# Altium schematic sheet OpenUltrasound_Pulser.SchDoc
size A3
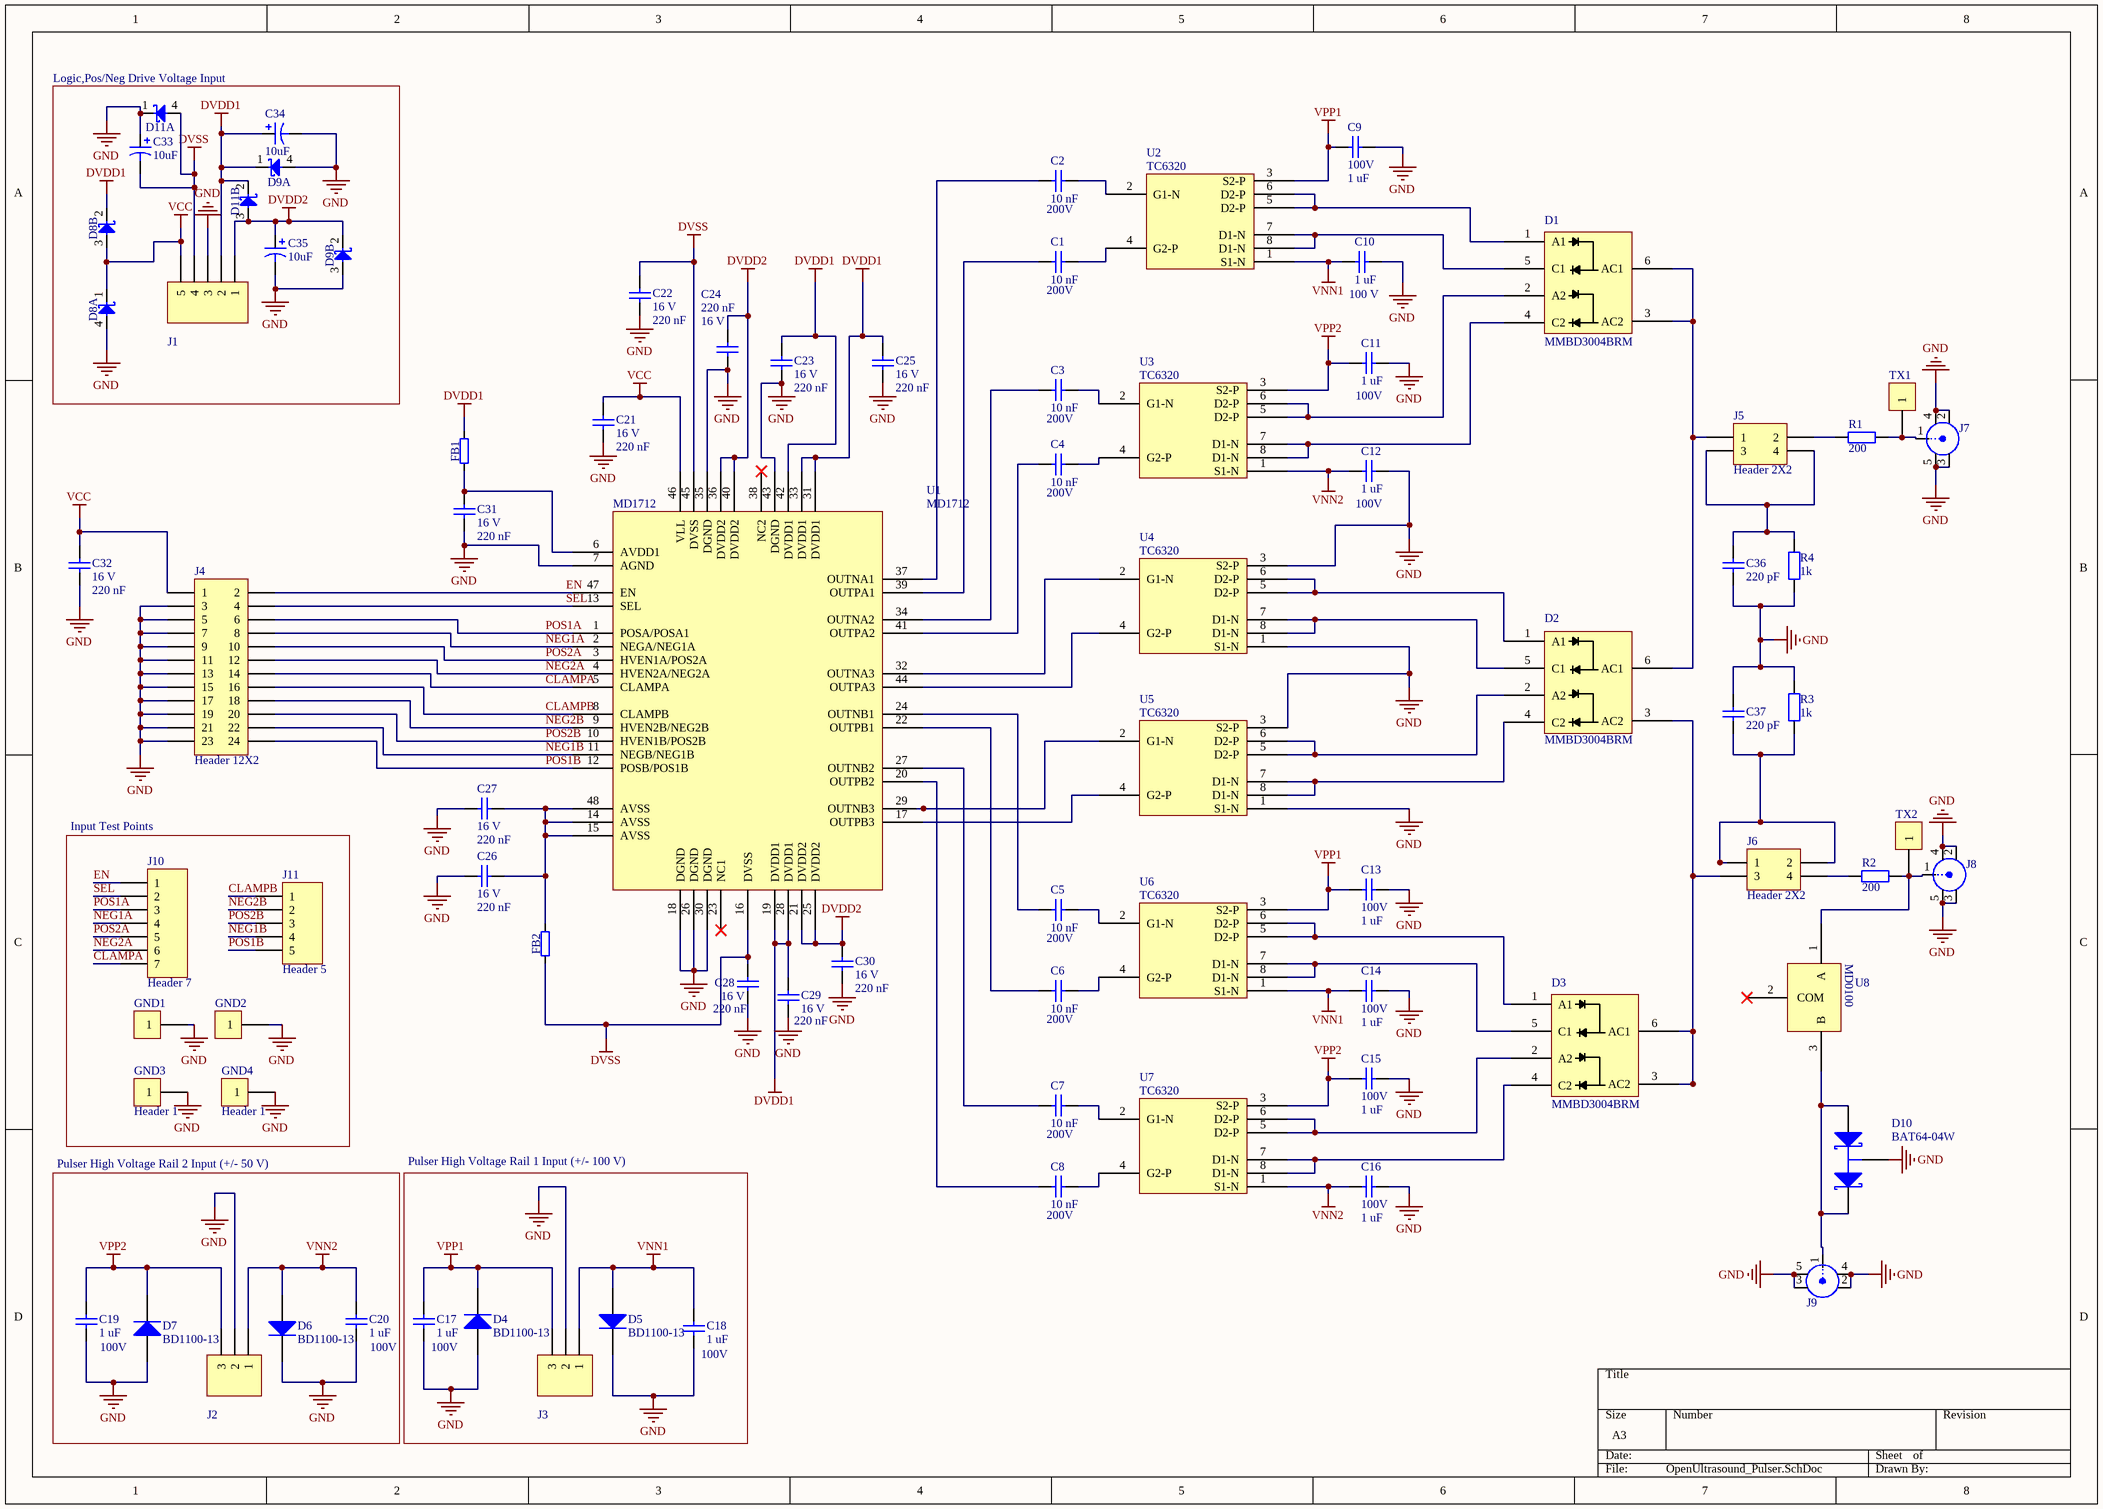
[diagram p0: OpenUltrasound_Pulser.SchDoc]

## Parts
C1  200V  value 10 nF  [CAP1608X100N]
C2  200V  value 10 nF  [CAP1608X100N]
C3  200V  value 10 nF  [CAP1608X100N]
C4  200V  value 10 nF  [CAP1608X100N]
C5  200V  value 10 nF  [CAP1608X100N]
C6  200V  value 10 nF  [CAP1608X100N]
C7  200V  value 10 nF  [CAP1608X100N]
C8  200V  value 10 nF  [CAP1608X100N]
C9  100V  value 1 uF  [CAP3216X180N]
C10  100 V  value 1 uF  [CAP3216X180N]
C11  100V  value 1 uF  [CAP3216X180N]
C12  100V  value 1 uF  [CAP3216X180N]
C13  100V  value 1 uF  [CAP3216X180N]
C14  100V  value 1 uF  [CAP3216X180N]
C15  100V  value 1 uF  [CAP3216X180N]
C16  100V  value 1 uF  [CAP3216X180N]
C17  100V  value 1 uF  [CAP3216X180N]
C18  100V  value 1 uF  [CAP3216X180N]
C19  100V  value 1 uF  [CAP3216X180N]
C20  100V  value 1 uF  [CAP3216X180N]
C21  16 V  value 220 nF  [CAP1608X100N]
C22  16 V  value 220 nF  [CAP1608X100N]
C23  16 V  value 220 nF  [CAP1608X100N]
C24  16 V  value 220 nF  [CAP1608X100N]
C25  16 V  value 220 nF  [CAP1608X100N]
C26  16 V  value 220 nF  [CAP1608X100N]
C27  16 V  value 220 nF  [CAP1608X100N]
C28  16 V  value 220 nF  [CAP1608X100N]
C29  16 V  value 220 nF  [CAP1608X100N]
C30  16 V  value 220 nF  [CAP1608X100N]
C31  16 V  value 220 nF  [CAP1608X100N]
C32  16 V  value 220 nF  [CAP1608X100N]
C33  10uF  [CAPAE530X540N]
C34  10uF  [CAPAE530X540N]
C35  10uF  [CAPAE530X540N]
C36  220 pF  [CAP1608X100N]
C37  220 pF  [CAP1608X100N]
D1  MMBD3004BRM  [SOT26A-6AN]
D2  MMBD3004BRM  [SOT26A-6AN]
D3  MMBD3004BRM  [SOT26A-6AN]
D4  BD1100-13  [ST DO214AC SMA]
D5  BD1100-13  [ST DO214AC SMA]
D6  BD1100-13  [ST DO214AC SMA]
D7  BD1100-13  [ST DO214AC SMA]
D8  (no value)  [SOT143L]  (parts A,B of 2)
D9  (no value)  [SOT143L]  (parts A,B of 2)
D10  BAT64-04W  [SOT-323]
D11  (no value)  [SOT143L]  (parts A,B of 2)
FB1  (no value)  [CAP1608X85N]
FB2  (no value)  [CAP1608X85N]
GND1  Header 1  [HDR1X1]  (value not drawn)
GND2  Header 1  [HDR1X1]  (value not drawn)
GND3  Header 1  [HDR1X1]
GND4  Header 1  [HDR1X1]
J1  Header 5 - pin  [B5B-XH-A]  (value not drawn)
J2  Header 3 - pin  [B3B-XH-A]  (value not drawn)
J3  Header 3 - pin  [B3B-XH-A]  (value not drawn)
J4  Header 12X2  [HDR2X12]
J5  Header 2X2  [HDR2X2]
J6  Header 2X2  [HDR2X2]
J7  SMA_EDGE_MOUNT  [SMA-J-P-X-ST-EM1]  (value not drawn)
J8  SMA_EDGE_MOUNT  [SMA-J-P-X-ST-EM1]  (value not drawn)
J9  SMA_EDGE_MOUNT  [SMA-J-P-X-ST-EM1]  (value not drawn)
J10  Header 7  [HDR1X7]
J11  Header 5  [HDR1X5]
R1  200  [RESC2012X70N-0805]
R2  200  [RESC2012X70N-0805]
R3  1k  [RESC3216X80N-1206]
R4  1k  [RESC3216X80N-1206]
TX1  Header 1  [HDR1X1]  (value not drawn)
TX2  Header 1  [HDR1X1]  (value not drawn)
U1  MD1712  [LQFP-48]
U2  TC6320  [SOIC127P600X175-8N]  (value not drawn)
U3  TC6320  [SOIC127P600X175-8N]  (value not drawn)
U4  TC6320  [SOIC127P600X175-8N]  (value not drawn)
U5  TC6320  [SOIC127P600X175-8N]  (value not drawn)
U6  TC6320  [SOIC127P600X175-8N]  (value not drawn)
U7  TC6320  [SOIC127P600X175-8N]  (value not drawn)
U8  MD0100  [SOT89]  (value not drawn)

## Blocks framed on the sheet
Logic,Pos/Neg Drive Voltage Input: C33-C35 D8 D9 D11 J1
Input Test Points: GND1-GND4 J10 J11
Pulser High Voltage Rail 2 Input (+/- 50 V): C19 C20 D6 D7 J2
Pulser High Voltage Rail 1 Input (+/- 100 V): C17 C18 D4 D5 J3

## Nets
DVDD1: C23.2 C25.2 C29.2 C34.1 D8.2(C2) D9.1(A2) D11.2(C2) FB1.2 J1.2 U1.19(DVDD1) U1.28(DVDD1) U1.31(DVDD1) U1.33(DVDD1) U1.42(DVDD1)
DVDD2: C24.2 C30.2 C35.1 D9.2(C2) D11.3(A1) J1.1 U1.21(DVDD2) U1.25(DVDD2) U1.36(DVDD2) U1.40(DVDD2)
DVSS: C22.2 C28.2 C33.2 D11.4(C1) FB2.1 J1.4 U1.16(DVSS) U1.45(DVSS)
GND: C9.1 C10.2 C11.1 C12.1 C13.1 C14.1 C15.1 C16.1 C17.1 C18.1 C19.1 C20.1 C21.1 C22.1 C23.1 C24.1 C25.1 C26.2 C27.2 C28.1 C29.1 C30.1 C31.1 C32.1 C33.1 C34.2 C35.2 C36.1 C37.2 D4.1 D5.2 D6.2 D7.1 D8.4(C1) D9.3(A1) D9.4(C1) D10.3(C) D11.1(A2) GND1.1 GND2.1 GND3.1 GND4.1 J1.3 J2.2 J3.2 J4.3 J4.5 J4.7 J4.9 J4.11 J4.13 J4.15 J4.17 J4.19 J4.21 J4.23 J7.2(Y) J7.3 J7.4 J7.5 J8.2(Y) J8.3 J8.4 J8.5 J9.2(Y) J9.3 J9.4 J9.5 R3.2 R4.1 U1.7(AGND) U1.18(DGND) U1.26(DGND) U1.30(DGND) U1.35(DGND) U1.43(DGND) U4.1(S1-N) U4.3(S2-P) U5.1(S1-N) U5.3(S2-P)
VCC: C21.2 C32.2 D8.1(A2) D8.3(A1) J1.5 J4.1 U1.46(VLL)
VNN1: C10.1 C14.2 C18.2 D5.1 J3.1 U2.1(S1-N) U6.1(S1-N)
VNN2: C12.2 C16.2 C20.2 D6.1 J2.1 U3.1(S1-N) U7.1(S1-N)
VPP1: C9.2 C13.2 C17.2 D4.2 J3.3 U2.3(S2-P) U6.3(S2-P)
VPP2: C11.2 C15.2 C19.2 D7.2 J2.3 U3.3(S2-P) U7.3(S2-P)
CLAMPA: J4.14 J10.7 U1.5(CLAMPA)
CLAMPB: J4.16 J11.1 U1.8(CLAMPB)
EN: J4.2 J10.1 U1.47(EN)
NEG1A: J4.8 J10.4 U1.2(NEGA/NEG1A)
NEG1B: J4.22 J11.4 U1.11(NEGB/NEG1B)
NEG2A: J4.12 J10.6 U1.4(HVEN2A/NEG2A)
NEG2B: J4.18 J11.2 U1.9(HVEN2B/NEG2B)
POS1A: J4.6 J10.3 U1.1(POSA/POSA1)
POS1B: J4.24 J11.5 U1.12(POSB/POS1B)
POS2A: J4.10 J10.5 U1.3(HVEN1A/POS2A)
POS2B: J4.20 J11.3 U1.10(HVEN1B/POS2B)
SEL: J4.4 J10.2 U1.13(SEL)
NetC1_1: C1.1 U1.39(OUTPA1)
NetC1_2: C1.2 U2.4(G2-P)
NetC2_1: C2.1 U1.37(OUTNA1)
NetC2_2: C2.2 U2.2(G1-N)
NetC3_1: C3.1 U1.34(OUTNA2)
NetC3_2: C3.2 U3.2(G1-N)
NetC4_1: C4.1 U1.41(OUTPA2)
NetC4_2: C4.2 U3.4(G2-P)
NetC5_1: C5.1 U1.24(OUTNB1)
NetC5_2: C5.2 U6.2(G1-N)
NetC6_1: C6.1 U1.22(OUTPB1)
NetC6_2: C6.2 U6.4(G2-P)
NetC7_1: C7.1 U1.27(OUTNB2)
NetC7_2: C7.2 U7.2(G1-N)
NetC8_1: C8.1 U1.20(OUTPB2)
NetC8_2: C8.2 U7.4(G2-P)
NetC26_1: C26.1 C27.1 FB2.2 U1.14(AVSS) U1.15(AVSS) U1.48(AVSS)
NetC31_2: C31.2 FB1.1 U1.6(AVDD1)
NetC36_2: C36.2 J5.3 J5.4 R4.2
NetC37_1: C37.1 J6.1 J6.2 R3.1
NetD1_1: D1.1(A1) U2.5(D2-P) U2.6(D2-P)
NetD1_2: D1.2(A2) U3.5(D2-P) U3.6(D2-P)
NetD1_3: D1.3(AC2) D1.6(AC1) D2.6(AC1) J5.1
NetD1_4: D1.4(C2) U3.7(D1-N) U3.8(D1-N)
NetD1_5: D1.5(C1) U2.7(D1-N) U2.8(D1-N)
NetD2_1: D2.1(A1) U4.5(D2-P) U4.6(D2-P)
NetD2_2: D2.2(A2) U5.5(D2-P) U5.6(D2-P)
NetD2_3: D2.3(AC2) D3.3(AC2) D3.6(AC1) J6.3
NetD2_4: D2.4(C2) U5.7(D1-N) U5.8(D1-N)
NetD2_5: D2.5(C1) U4.7(D1-N) U4.8(D1-N)
NetD3_1: D3.1(A1) U6.5(D2-P) U6.6(D2-P)
NetD3_2: D3.2(A2) U7.5(D2-P) U7.6(D2-P)
NetD3_4: D3.4(C2) U7.7(D1-N) U7.8(D1-N)
NetD3_5: D3.5(C1) U6.7(D1-N) U6.8(D1-N)
NetD10_1: D10.1(A) D10.2(K) J9.1(X) U8.3(B)
NetJ5_2: J5.2 R1.1
NetJ6_4: J6.4 R2.1
NetJ7_1: J7.1(X) R1.2 TX1.1
NetJ8_1: J8.1(X) R2.2 TX2.1 U8.1(A)
NetU1_17: U1.17(OUTPB3) U5.4(G2-P)
NetU1_29: U1.29(OUTNB3) U5.2(G1-N)
NetU1_32: U1.32(OUTNA3) U4.2(G1-N)
NetU1_44: U1.44(OUTPA3) U4.4(G2-P)

Not connected (* = marked no-connect by the designer): U1 23(NC1)* 38(NC2)*; U8 2(COM)*

## Library data of the parts
C1-C8 C21-C32 C36 C37 = CAP0603: Capacitor
  C36 C37: Value: 220 pF
C9-C20 = CAP1206: Capacitor
C33-C35 = CAP POL: Polarized Capacitor (Radial Can SMD); Value: 10uF
D1-D3 = MMBD3004BRM: High Voltage Surface Mount Switching Diode Array
D8 D9 D11 = Diode Schottky x2 A4C1_A3C2: Serial Schottky Diode
D10 = BAT64-04W: Silicon AF Schottky Diode for Low-Loss, Fast-Recovery, Meter Protection; Published: 21-Mar-2003; DatasheetDocument: Oct-1999; PackageDocument: Sep-2001; PackageReference: SOT-323; Publisher: Altium Limited; ComponentLink1Description: Manufacturer Link; ComponentLink1URL: http://www.infineon.com/; ComponentLink2Description: Datasheet; ComponentLink2URL: http://www.infineon.com/upload/Document/cmc_upload/documents/009/395/bat64series.pdf
FB1 FB2 = Ferrite Bead
GND1-GND4 TX1 TX2 = Header 1: Header, 1-Pin; LatestRevisionDate: 17-Jul-2002; LatestRevisionNote: Re-released for DXP Platform.; Publisher: Altium Limited
J1 = B5B-XH-A: Header, 5-pin; pin to pad: 1>5 2>4 4>2 5>1; LatestRevisionDate: 17-Jul-2002; LatestRevisionNote: Re-released for DXP Platform.; Publisher: Altium Limited
J2 J3 = B3B-XH-A: Header, 3-pin; LatestRevisionDate: 17-Jul-2002; LatestRevisionNote: Re-released for DXP Platform.; Publisher: Altium Limited
J4 = Header 12X2: Header, 12-Pin, Dual row; LatestRevisionDate: 17-Jul-2002; LatestRevisionNote: Re-released for DXP Platform.; Publisher: Altium Limited
J5 J6 = Header 2X2: Header, 2-Pin, Dual row; LatestRevisionDate: 17-Jul-2002; LatestRevisionNote: Re-released for DXP Platform.; Publisher: Altium Limited
J7-J9 = SMA_EDGE_MOUNT: BNC Elbow Connector; LatestRevisionDate: 17-Jul-2002; LatestRevisionNote: Re-released for DXP Platform.; Publisher: Altium Limited
J10 = Header 7: Header, 7-Pin; LatestRevisionDate: 17-Jul-2002; LatestRevisionNote: Re-released for DXP Platform.; Publisher: Altium Limited
J11 = Header 5: Header, 5-Pin; LatestRevisionDate: 17-Jul-2002; LatestRevisionNote: Re-released for DXP Platform.; Publisher: Altium Limited
R1 R2 = RES0805: Resistor; Value: 200
R3 R4 = RES1206: Resistor; Value: 1k
U1 = MD1712: High Speed, Integrated Ultrasound Driver IC
U8 = MD0100: High voltage protection T/R switch